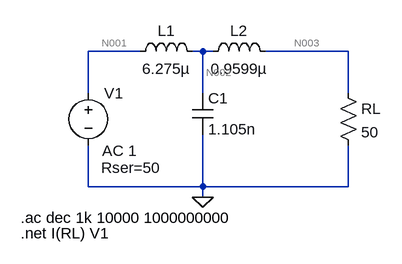
[diagram p0: schematic EJ1_Valores.asc]
EJ1_Valores.asc, the LTspice schematic file:
Version 4
SHEET 1 880 680
WIRE 32 96 -48 96
WIRE 128 96 112 96
WIRE 144 96 128 96
WIRE 352 96 224 96
WIRE -48 160 -48 96
WIRE 128 160 128 96
WIRE 352 160 352 96
WIRE -48 304 -48 240
WIRE 128 304 128 224
WIRE 128 304 -48 304
WIRE 352 304 352 240
WIRE 352 304 128 304
WIRE 128 320 128 304
FLAG 128 320 0
SYMBOL voltage -48 144 R0
WINDOW 123 21 105 Left 2
WINDOW 39 20 131 Left 2
SYMATTR Value2 AC 1
SYMATTR SpiceLine Rser=50
SYMATTR InstName V1
SYMATTR Value ""
SYMBOL ind 16 112 R270
WINDOW 0 32 56 VTop 2
WINDOW 3 5 56 VBottom 2
SYMATTR InstName L1
SYMATTR Value 6.275µ
SYMBOL cap 112 160 R0
SYMATTR InstName C1
SYMATTR Value 1.105n
SYMBOL ind 128 112 R270
WINDOW 0 32 56 VTop 2
WINDOW 3 5 56 VBottom 2
SYMATTR InstName L2
SYMATTR Value 0.9599µ
SYMBOL res 336 144 R0
SYMATTR InstName RL
SYMATTR Value 50
TEXT -152 352 Left 2 !.ac dec 1k 10000 1000000000
TEXT -152 376 Left 2 !.net I(RL) V1

The netlist it stands for:
* EJ1_Valores.asc
V1 N001 0 AC 1 Rser=50
L1 N001 N002 6.275µ
C1 N002 0 1.105n
L2 N002 N003 0.9599µ
RL N003 0 50
.ac dec 1k 10000 1000000000
.net I(RL) V1
.backanno
.end

* Results of the author's LTspice run, read from the files saved beside the schematic
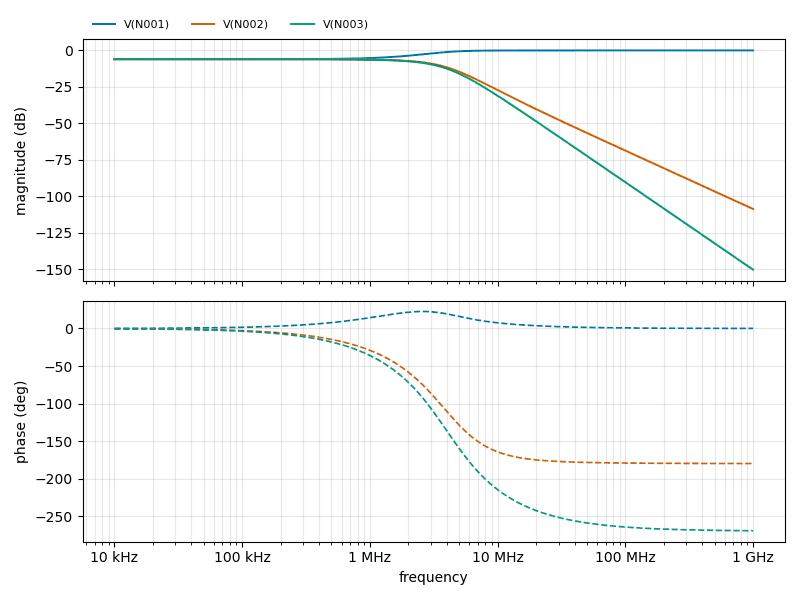
[diagram p1: AC Analysis of EJ1_Valores.asc, plotted from the saved traces]
* AC Analysis, 1 run:
*   V(N001): -6.02 dB at 10 kHz, -0.00 dB at 1 GHz, peak -0.00 dB at 1 GHz, 3 dB below the peak at 2.383 MHz
*   V(N002): -6.02 dB at 10 kHz, -108.75 dB at 1 GHz, peak -6.02 dB at 10 kHz, 3 dB below the peak at 3.013 MHz
*   V(N003): -6.02 dB at 10 kHz, -150.38 dB at 1 GHz, peak -6.02 dB at 10 kHz, 3 dB below the peak at 2.794 MHz